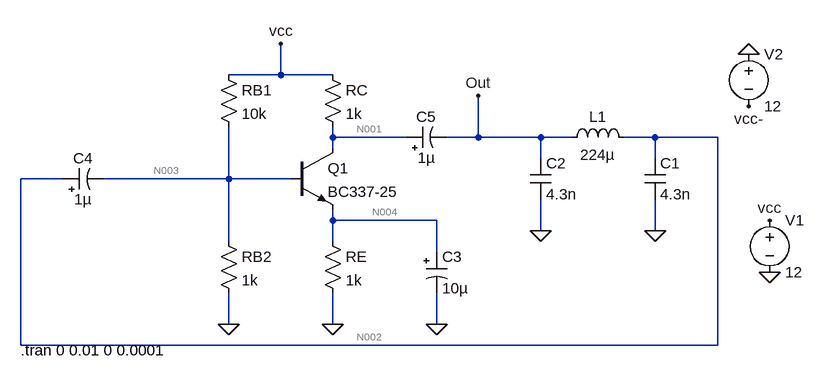
[diagram p0: schematic ColpittsMenDenVirker.asc]
ColpittsMenDenVirker.asc, the LTspice schematic file:
Version 4
SHEET 1 880 680
WIRE -64 16 -64 -32
WIRE -64 16 -144 16
WIRE 16 16 -64 16
WIRE 16 112 16 96
WIRE 128 112 16 112
WIRE 240 112 240 48
WIRE 240 112 192 112
WIRE 336 112 240 112
WIRE 384 112 336 112
WIRE 512 112 464 112
WIRE 608 112 512 112
WIRE 16 128 16 112
WIRE 336 144 336 112
WIRE 512 144 512 112
WIRE -400 176 -464 176
WIRE -144 176 -144 96
WIRE -144 176 -336 176
WIRE -48 176 -144 176
WIRE 16 240 16 224
WIRE 176 240 16 240
WIRE 336 256 336 208
WIRE 512 256 512 208
WIRE -144 272 -144 176
WIRE 16 272 16 240
WIRE 176 288 176 240
WIRE -144 400 -144 352
WIRE 16 400 16 352
WIRE 176 400 176 352
WIRE -464 432 -464 176
WIRE 608 432 608 112
WIRE 608 432 -464 432
FLAG -144 400 0
FLAG -64 -32 vcc
FLAG 688 240 vcc
FLAG 688 320 0
FLAG 240 48 Out
FLAG 656 -16 0
FLAG 656 64 vcc-
FLAG 16 400 0
FLAG 176 400 0
FLAG 336 256 0
FLAG 512 256 0
SYMBOL res -160 0 R0
SYMATTR InstName RB1
SYMATTR Value 10k
SYMBOL res 0 0 R0
SYMATTR InstName RC
SYMATTR Value 1k
SYMBOL res 0 256 R0
SYMATTR InstName RE
SYMATTR Value 1k
SYMBOL res -160 256 R0
SYMATTR InstName RB2
SYMATTR Value 1k
SYMBOL cap 320 144 R0
SYMATTR InstName C2
SYMATTR Value 4.3n
SYMBOL cap 496 144 R0
SYMATTR InstName C1
SYMATTR Value 4.3n
SYMBOL ind 368 128 R270
WINDOW 0 32 56 VTop 2
WINDOW 3 5 56 VBottom 2
SYMATTR InstName L1
SYMATTR Value 224µ
SYMBOL polcap 160 288 R0
SYMATTR InstName C3
SYMATTR Value 10µ
SYMBOL voltage 688 224 R0
WINDOW 123 0 0 Left 0
WINDOW 39 0 0 Left 0
SYMATTR InstName V1
SYMATTR Value 12
SYMBOL npn -48 128 R0
SYMATTR InstName Q1
SYMATTR Value BC337-25
SYMBOL voltage 656 -32 R0
WINDOW 123 0 0 Left 0
WINDOW 39 0 0 Left 0
SYMATTR InstName V2
SYMATTR Value 12
SYMBOL polcap -400 192 R270
WINDOW 0 32 32 VTop 2
WINDOW 3 0 32 VBottom 2
SYMATTR InstName C4
SYMATTR Value 1µ
SYMBOL polcap 128 128 R270
WINDOW 0 32 32 VTop 2
WINDOW 3 0 32 VBottom 2
SYMATTR InstName C5
SYMATTR Value 1µ
TEXT -464 440 Left 2 !.tran 0 0.01 0 0.0001

The netlist it stands for:
* ColpittsMenDenVirker.asc
RB1 vcc N003 10k
RC vcc N001 1k
RE N004 0 1k
RB2 N003 0 1k
C2 Out 0 4.3n
C1 N002 0 4.3n
L1 Out N002 224µ
C3 N004 0 10µ
V1 vcc 0 12
Q1 N001 N003 N004 0 BC337-25
V2 0 vcc- 12
C4 N002 N003 1µ
C5 N001 Out 1µ
.model NPN NPN
.model PNP PNP
.lib standard.bjt
.tran 0 0.01 0 0.0001
.backanno
.end

* Results of the author's LTspice run, read from the files saved beside the schematic
* Operating Point, zero values left out:
*   V(vcc) = 12 V
*   V(n003) = 1.089 V
*   V(n001) = 11.5 V
*   V(n004) = 500.5 mV
*   V(out) = 12.31 µV
*   V(n002) = 12.31 µV
*   V(vcc-) = -12 V
*   Ic(Q1) = 498.8 µA
*   Ib(Q1) = 1.712 µA
*   Ie(Q1) = -500.5 µA
*   I(Rb1) = 1.091 mA
*   I(Rc) = 498.8 µA
*   I(Re) = 500.5 µA
*   I(Rb2) = 1.089 mA
*   I(V1) = -1.59 mA